# EAGLE schematic rc360detector_102315_10_15 (EAGLE 7.4.0)
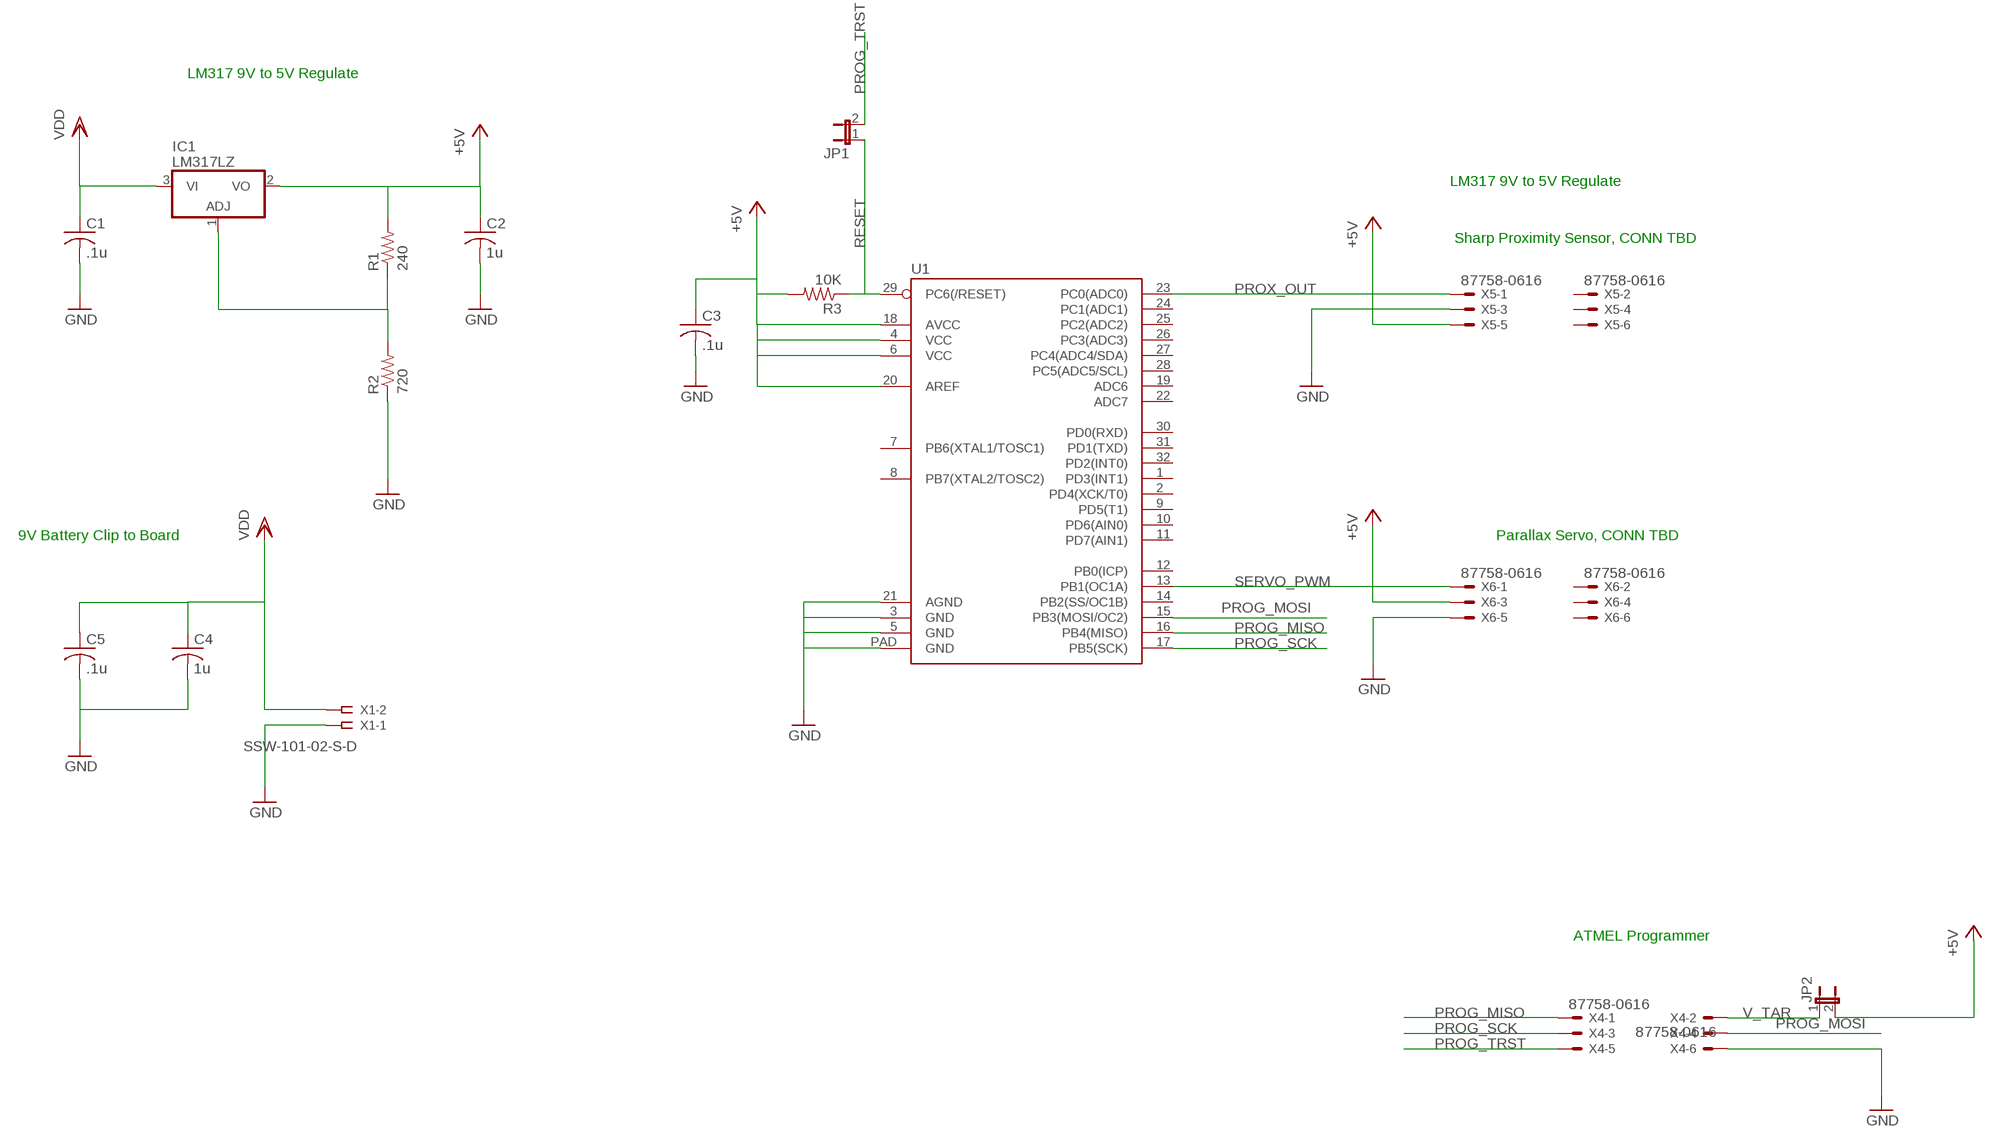
[diagram p0: schematic, sheet 1]

## Parts
C1  .1u  C-USC0603  [C0603]
C2  1u  C-USC0603  [C0603]
C3  .1u  C-USC0603  [C0603]
C4  1u  C-USC0603  [C0603]
C5  .1u  C-USC0603  [C0603]
IC1  LM317LZ  [TO92]
JP1  JP1E  [JP1]
JP2  JP1E  [JP1]
R1  240  R-US_R0603  [R0603]
R2  720  R-US_R0603  [R0603]
R3  10K  R-US_R0603  [R0603]
U1  ATMEGA328P_MLFMLF32  [MLF32-PAD]
X1  SSW-101-02-S-D  [SSW-101-02-S-D]
X4  87758-0616  [87758-0616]
X5  87758-0616  [87758-0616]
X6  87758-0616  [87758-0616]

## Nets
+5V: C2.1 C3.1 IC1.2(VO) JP2.2 R1.2 R3.2 U1.18(AVCC) U1.20(AREF) X5.5 X6.3
GND: C1.2 C4.2 C5.2 R2.1 X1.1 X5.3 X6.5
N$3: IC1.1(ADJ) R1.1 R2.2
PROG_MISO: U1.16(PB4(MISO))
PROG_MOSI: U1.15(PB3(MOSI/OC2))
PROG_TRST: JP1.2
PROX_OUT: X5.1
RESET: JP1.1 R3.1 U1.29(PC6(/RESET))
SERVO_PWM: X6.1
V_TAR: JP2.1
VDD: C1.1 C4.1 C5.1 IC1.3(VI) X1.2
Unconnected: C2.2 C3.2 U1.1(PD3(INT1)) U1.2(PD4(XCK/T0)) U1.3(GND) U1.4(VCC) U1.5(GND) U1.6(VCC) U1.7(PB6(XTAL1/TOSC1)) U1.8(PB7(XTAL2/TOSC2)) U1.9(PD5(T1)) U1.10(PD6(AIN0)) U1.11(PD7(AIN1)) U1.12(PB0(ICP)) U1.13(PB1(OC1A)) U1.14(PB2(SS/OC1B)) U1.17(PB5(SCK)) U1.19(ADC6) U1.21(AGND) U1.22(ADC7) U1.23(PC0(ADC0)) U1.24(PC1(ADC1)) U1.25(PC2(ADC2)) U1.26(PC3(ADC3)) U1.27(PC4(ADC4/SDA)) U1.28(PC5(ADC5/SCL)) U1.30(PD0(RXD)) U1.31(PD1(TXD)) U1.32(PD2(INT0)) U1.PAD(GND) X4.1 X4.2 X4.3 X4.4 X4.5 X4.6 X5.2 X5.4 X5.6 X6.2 X6.4 X6.6

## Notes on the sheet
- LM317 9V to 5V Regulate
- LM317 9V to 5V Regulate
- Sharp Proximity Sensor, CONN TBD
- 9V Battery Clip to Board | Parallax Servo, CONN TBD
- ATMEL Programmer

## Library data of the parts
C1-C5 = resistor:C-US: CAPACITOR, American symbol
IC1 = linear:*317: Positive VOLTAGE REGULATOR
JP1 JP2 = jumper:JP1E: JUMPER
R1-R3 = resistor:R-US_: RESISTOR, American symbol
U1 = SparkFun-DigitalIC:ATMEGA328P_MLF: 32-Pin Atmega328 part Commonly used on Arduino compatible boards Available in QFP and QFN packages TQFP is IC-09069 QFN is non-stock
X1 = con-samtec:SSW-101-02-S-D: THROUGH-HOLE .025" SQ POST SOCKET Source: Samtec SSW.pdf; MPN: SSW-101-02-S-D; OC_FARNELL: unknown; OC_NEWARK: 82P1456
X4-X6 = con-molex:87758-0616: 6 Pin - 2mm Dual Row Single Wafer, Vertical T/H HDR Source: http://www.molex.com/pdm_docs/sd/877580616_sd.pdf; MPN: 87758-0616; OC_FARNELL: 7472323; OC_NEWARK: 25M5667